# Altium schematic sheet Sheet1.SchDoc
size A4; SheetNumber: 1; SheetTotal: 1
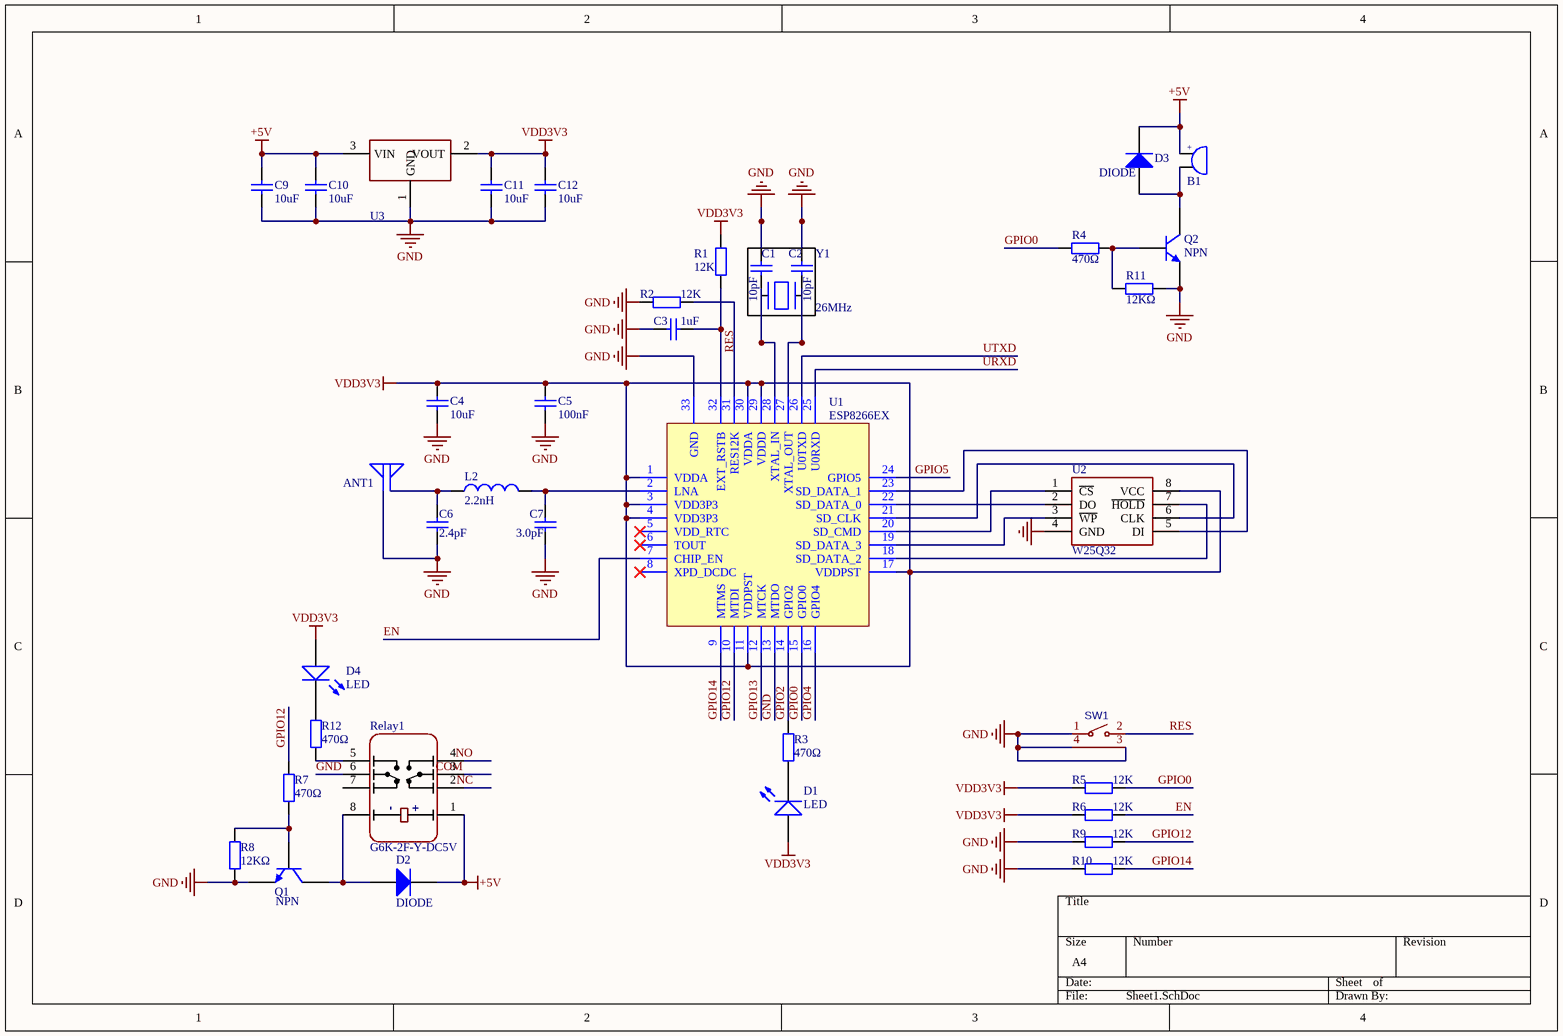
[diagram p0: Sheet1.SchDoc]

## Parts
ANT1  ANT  [ESP8266-WiiFi-ANT]  (value not drawn)
B1  BEEP  [BUZZER-5020]  (value not drawn)
C1  10pF  [0402C]
C2  10pF  [0402C]
C3  1uF  [0402C]
C4  10uF  [0603C]
C5  100nF  [0603C]
C6  2.4pF  [0402C]
C7  3.0pF  [0402C]
C9  10uF  [0603C]
C10  10uF  [0603C]
C11  10uF  [0603C]
C12  10uF  [0603C]
D1  LED  [0603LED]
D2  DIODE  [DIODE-SOD-323]
D3  DIODE  [DIODE-SOD-323]
D4  LED  [0603LED]
L2  2.2nH  [0402L]
Q1  NPN  [SOT-23-3]
Q2  NPN  [SOT-23-3]
R1  12K  [0402R]
R2  12K  [0402R]
R3  470Ω  [0402R]
R4  470Ω  [0402R]
R5  12K  [0402R]
R6  12K  [0402R]
R7  470Ω  [0402R]
R8  12KΩ  [0402R]
R9  12K  [0402R]
R10  12K  [0402R]
R11  12KΩ  [0402R]
R12  470Ω  [0402R]
Relay1  G6K-2F-Y-DC5V  [RELAY-G6K-2F-Y]
SW1  SWITCH_4P_SIDE_PRESS  [SWITCH_SMD_2P_SIDE_PRESS]  (value not drawn)
U1  ESP8266EX  [QFN-32-ESP8266EX]
U2  W25Q32  [SOIC-8]
U3  AMS1117  [SOT-89-3]  (value not drawn)
Y1  26MHz  [SMD-3225-4Pin]

## Nets
+5V: B1.1 C9.2 C10.2 D2.2(K) D3.2(K) Relay1.1(+) U3.3(VIN)
GND: ANT1.1(GND) C1.2 C2.2 C3.2 C4.1 C5.2 C6.2 C7.2 C9.1 C10.1 C11.1 C12.1 Q1.2(E) Q2.2(E) R2.2 R8.2 R9.2 R10.2 R11.2 Relay1.6(NO) SW1.1 SW1.3 SW1.4 U1.13(MTDO) U1.33(GND) U2.4(GND) U3.1(GND) Y1.2(G) Y1.4(G)
VDD3V3: C4.2 C5.1 C11.2 C12.2 D1.1 D4.1 R1.2 R5.2 R6.2 U1.1(VDDA) U1.3(VDD3P3) U1.4(VDD3P3) U1.11(VDDPST) U1.17(VDDPST) U1.29(VDDD) U1.30(VDDA) U2.8(VCC) U3.2(VOUT)
COM: Relay1.3(COM)
EN: R6.1 U1.7(CHIP_EN)
GPIO0: R4.1 R5.1 U1.15(GPIO0)
GPIO2: R3.1 U1.14(GPIO2)
GPIO4: U1.16(GPIO4)
GPIO5: U1.24(GPIO5)
GPIO12: R7.1 R9.1 U1.10(MTDI)
GPIO13: U1.12(MTCK)
GPIO14: R10.1 U1.9(MTMS)
NC: Relay1.2(NC)
NO: Relay1.4(NO)
RES: C3.1 R1.1 SW1.2 U1.32(EXT_RSTB)
URXD: U1.25(U0RXD)
UTXD: U1.26(U0TXD)
NetANT1_2: ANT1.2(ANT) C6.1 L2.1
NetB1_2: B1.2 D3.1(A) Q2.3(C)
NetC1_1: C1.1 U1.28(XTAL_IN) Y1.1(I)
NetC2_1: C2.1 U1.27(XTAL_OUT) Y1.3(O)
NetC7_1: C7.1 L2.2 U1.2(LNA)
NetD1_2: D1.2 R3.2
NetD2_1: D2.1(A) Q1.3(C) Relay1.8(-)
NetD4_2: D4.2 R12.2
NetQ1_1: Q1.1(B) R7.2 R8.1
NetQ2_1: Q2.1(B) R4.2 R11.1
NetR2_1: R2.1 U1.31(RES12K)
NetR12_1: R12.1 Relay1.5(NO)
NetU1_18: U1.18(SD_DATA_2) U2.7(~{HOLD})
NetU1_19: U1.19(SD_DATA_3) U2.3(~{WP})
NetU1_20: U1.20(SD_CMD) U2.1(~{CS})
NetU1_21: U1.21(SD_CLK) U2.6(CLK)
NetU1_22: U1.22(SD_DATA_0) U2.2(DO)
NetU1_23: U1.23(SD_DATA_1) U2.5(DI)

Not connected (* = marked no-connect by the designer): Relay1 7(NC); U1 5(VDD_RTC)* 6(TOUT)* 8(XPD_DCDC)*

## Notes on the sheet
- (in symbol BEEP) +

## Library data of the parts
ANT1 = ANT: WiFi天线
B1 = BEEP: 蜂鸣器; 版权归属: 源创客; BOM名称: 蜂鸣器; 学习资源: www.ooocke.com
C1 C2 C6 C7 = CAP: 贴片电容; ComponentLink1Description: 供应商链接; ComponentLink1URL: http://www.szlcsc.com/product/details_1911.html; Package: 0402; Supplier: LC; SuppliersPartNumber: C1559
C3 C5 = 0402 100nF (104) 10% 16V: 贴片电容; ComponentLink1Description: 供应商链接; ComponentLink1URL: http://www.szlcsc.com/product/details_1877.html; Package: 0402; Supplier: LC; SuppliersPartNumber: C1525
C4 C9-C12 = 0603 100nF (104) 10% 50V: 贴片电容; ComponentLink1Description: 供应商链接; ComponentLink1URL: http://www.szlcsc.com/product/details_15331.html; Package: 0603; Supplier: LC; SuppliersPartNumber: C14663
D1 D4 = LED: 发光二极管; ComponentLink1Description: 供应商链接; ComponentLink1URL: http://www.szlcsc.com/product/details_73152.html; Package: 0603; Supplier: LC; SuppliersPartNumber: C72043
D2 D3 = DIODE: 二极管; Notepad: 1N4007 4007 编号C2464 已经停售, 使用新物料编号C95872; ComponentLink1Description: 供应商链接; ComponentLink1URL: http://www.szlcsc.com/product/details_2841.html; Package: SMA(DO-214AC); Supplier: LC; SuppliersPartNumber: C95872
L2 = INDUCTOR: 电感; ComponentLink1Description: 供应商链接; ComponentLink1URL: http://www.szlcsc.com/product/details_12685.html; Package: 0603; Supplier: LC; SuppliersPartNumber: C12100
Q1 Q2 = NPN: 三极管; ComponentLink1Description: 供应商链接; ComponentLink1URL: http://www.szlcsc.com/product/details_2507.html; Package: SOT-23; Supplier: LC; SuppliersPartNumber: C2150
R1-R12 = 0402 1.2KΩ (1201) 1%: 贴片电阻; ComponentLink1Description: 供应商链接; ComponentLink1URL: http://www.szlcsc.com/product/details_26605.html; Package: 0402; Supplier: LC; SuppliersPartNumber: C25862
Relay1 = G6K-2F-Y-DC5V: 欧娒龙超小型信号继电器
SW1 = SWITCH_4P_SIDE_PRESS: 侧边轻触按键
U1 = ESP8266EX: WiFi芯片
U2 = W25Q32: SPI Flash
U3 = AMS1117: LDO降压芯片
Y1 = CRYSTAL: 贴片晶振; ComponentLink1Description: 供应商链接; ComponentLink1URL: http://www.szlcsc.com/product/details_9522.html; Package: SMD-3225_4P; Supplier: LC; SuppliersPartNumber: C9002